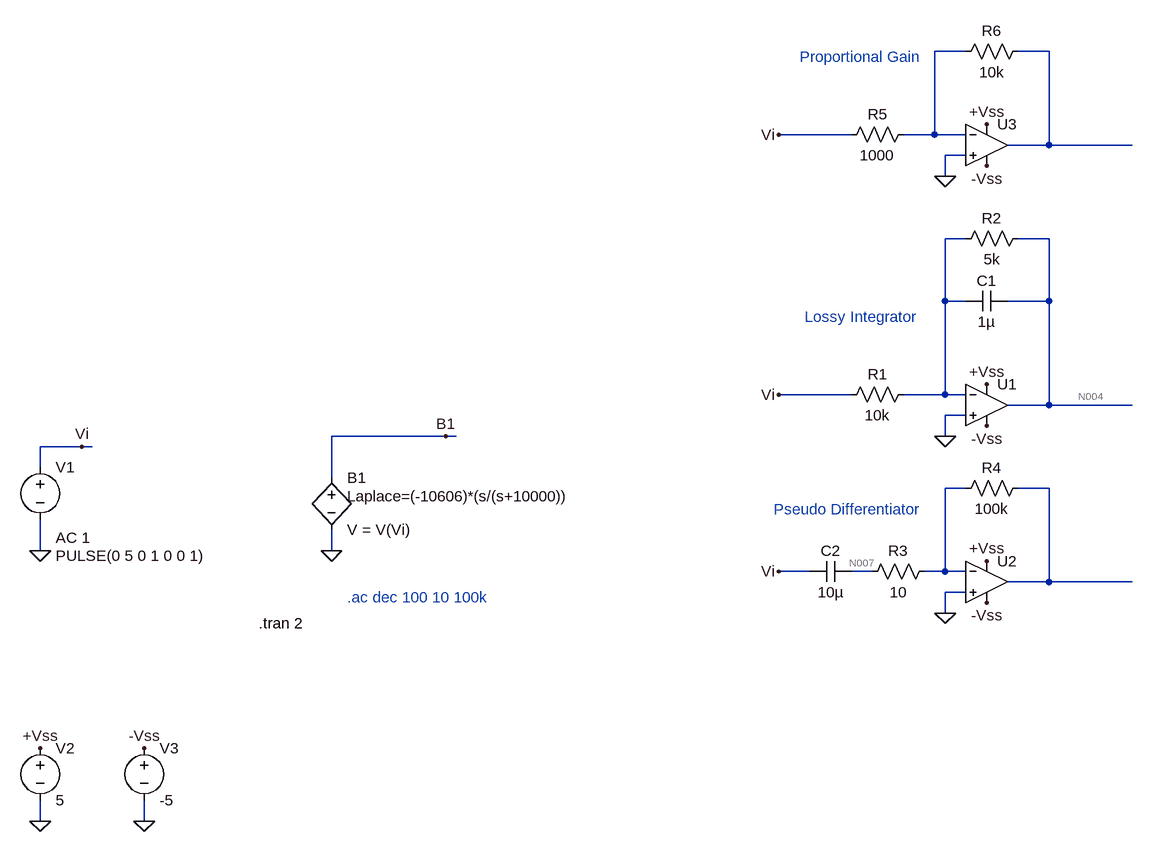
[diagram p0: schematic PID.asc]
PID.asc, the LTspice schematic file:
Version 4.1
SHEET 1 2436 884
WIRE 1152 -320 1104 -320
WIRE 1280 -320 1232 -320
WIRE 976 -192 864 -192
WIRE 1104 -192 1104 -320
WIRE 1104 -192 1056 -192
WIRE 1152 -192 1104 -192
WIRE 1280 -176 1280 -320
WIRE 1280 -176 1216 -176
WIRE 1408 -176 1280 -176
WIRE 1152 -160 1120 -160
WIRE 1120 -128 1120 -160
WIRE 1152 -32 1120 -32
WIRE 1280 -32 1232 -32
WIRE 1120 64 1120 -32
WIRE 1152 64 1120 64
WIRE 1280 64 1280 -32
WIRE 1280 64 1216 64
WIRE 976 208 864 208
WIRE 1120 208 1120 64
WIRE 1120 208 1056 208
WIRE 1152 208 1120 208
WIRE 1280 224 1280 64
WIRE 1280 224 1216 224
WIRE 1408 224 1280 224
WIRE 1152 240 1120 240
WIRE 352 272 176 272
WIRE 368 272 352 272
WIRE 1120 272 1120 240
WIRE -208 288 -272 288
WIRE -192 288 -208 288
WIRE -272 320 -272 288
WIRE 176 336 176 272
WIRE 1152 352 1120 352
WIRE 1280 352 1232 352
WIRE -272 448 -272 400
WIRE 176 448 176 416
WIRE 912 480 864 480
WIRE 1008 480 976 480
WIRE 1120 480 1120 352
WIRE 1120 480 1088 480
WIRE 1152 480 1120 480
WIRE 1280 496 1280 352
WIRE 1280 496 1216 496
WIRE 1408 496 1280 496
WIRE 1152 512 1120 512
WIRE 1120 544 1120 512
WIRE -272 864 -272 832
WIRE -112 864 -112 832
FLAG 176 448 0
FLAG -208 288 Vi
FLAG -272 448 0
FLAG 352 272 B1
FLAG 1120 272 0
FLAG 864 208 Vi
FLAG -272 864 0
FLAG -112 864 0
FLAG -272 752 +Vss
FLAG -112 752 -Vss
FLAG 1184 192 +Vss
FLAG 1184 256 -Vss
FLAG 864 480 Vi
FLAG 1120 544 0
FLAG 1184 528 -Vss
FLAG 1184 464 +Vss
FLAG 1120 -128 0
FLAG 864 -192 Vi
FLAG 1184 -144 -Vss
FLAG 1184 -208 +Vss
SYMBOL bv 176 320 R0
WINDOW 123 24 44 Left 2
SYMATTR Value2 Laplace=(-10606)*(s/(s+10000))
SYMATTR InstName B1
SYMATTR Value V = V(Vi)
SYMBOL voltage -272 304 R0
WINDOW 3 24 152 Left 2
WINDOW 123 24 124 Left 2
WINDOW 39 0 0 Left 0
SYMATTR Value PULSE(0 5 0 1 0 0 1)
SYMATTR Value2 AC 1
SYMATTR InstName V1
SYMBOL res 1072 192 R90
WINDOW 0 0 56 VBottom 2
WINDOW 3 32 56 VTop 2
SYMATTR InstName R1
SYMATTR Value 10k
SYMBOL res 1248 -48 R90
WINDOW 0 0 56 VBottom 2
WINDOW 3 32 56 VTop 2
SYMATTR InstName R2
SYMATTR Value 5k
SYMBOL voltage -272 736 R0
WINDOW 123 0 0 Left 0
WINDOW 39 0 0 Left 0
SYMATTR InstName V2
SYMATTR Value 5
SYMBOL voltage -112 736 R0
WINDOW 123 0 0 Left 0
WINDOW 39 0 0 Left 0
SYMATTR InstName V3
SYMATTR Value -5
SYMBOL OpAmps\\UniversalOpAmp2 1184 224 R0
SYMATTR InstName U1
SYMBOL cap 1216 48 R90
WINDOW 0 0 32 VBottom 2
WINDOW 3 32 32 VTop 2
SYMATTR InstName C1
SYMATTR Value 1µ
SYMBOL OpAmps\\UniversalOpAmp2 1184 496 R0
SYMATTR InstName U2
SYMBOL res 1104 464 R90
WINDOW 0 0 56 VBottom 2
WINDOW 3 32 56 VTop 2
SYMATTR InstName R3
SYMATTR Value 10
SYMBOL cap 976 464 R90
WINDOW 0 0 32 VBottom 2
WINDOW 3 32 32 VTop 2
SYMATTR InstName C2
SYMATTR Value 10µ
SYMBOL res 1248 336 R90
WINDOW 0 0 56 VBottom 2
WINDOW 3 32 56 VTop 2
SYMATTR InstName R4
SYMATTR Value 100k
SYMBOL OpAmps\\UniversalOpAmp2 1184 -176 R0
SYMATTR InstName U3
SYMBOL res 1072 -208 R90
WINDOW 0 0 56 VBottom 2
WINDOW 3 32 56 VTop 2
SYMATTR InstName R5
SYMATTR Value 1000
SYMBOL res 1248 -336 R90
WINDOW 0 0 56 VBottom 2
WINDOW 3 32 56 VTop 2
SYMATTR InstName R6
SYMATTR Value 10k
TEXT 200 520 Left 2 ;.ac dec 100 10 100k
TEXT 64 560 Left 2 !.tran 2
TEXT 856 384 Left 2 ;Pseudo Differentiator
TEXT 904 88 Left 2 ;Lossy Integrator
TEXT 896 -312 Left 2 ;Proportional Gain

The netlist it stands for:
* PID.asc
B1 B1 0 V = V(Vi) Laplace=(-10606)*(s/(s+10000))
V1 Vi 0 PULSE(0 5 0 1 0 0 1) AC 1
R1 N003 Vi 10k
R2 N004 N003 5k
V2 +Vss 0 5
V3 -Vss 0 -5
X§U1 0 N003 +Vss -Vss N004 level2 Avol=1Meg GBW=10Meg Slew=10Meg Ilimit=25m Rail=0 Vos=0 En=0 Enk=0 In=0 Ink=0 Rin=500Meg  ; pins In+ In- V+ V- OUT
C1 N004 N003 1µ
X§U2 0 N005 +Vss -Vss N006 level2 Avol=1Meg GBW=10Meg Slew=10Meg Ilimit=25m Rail=0 Vos=0 En=0 Enk=0 In=0 Ink=0 Rin=500Meg  ; pins In+ In- V+ V- OUT
R3 N005 N007 10
C2 N007 Vi 10µ
R4 N006 N005 100k
X§U3 0 N001 +Vss -Vss N002 level2 Avol=1Meg GBW=10Meg Slew=10Meg Ilimit=25m Rail=0 Vos=0 En=0 Enk=0 In=0 Ink=0 Rin=500Meg  ; pins In+ In- V+ V- OUT
R5 N001 Vi 1000
R6 N002 N001 10k
* .ac dec 100 10 100k
.tran 2
* Pseudo Differentiator
* Lossy Integrator
* Proportional Gain
.lib UniversalOpAmp2.lib
.backanno
.end

* Results of the author's LTspice run, read from the files saved beside the schematic
* Operating Point, zero values left out:
*   V(+vss) = 5 V
*   V(-vss) = -5 V
*   I(V2) = -1.5 mA
*   I(V3) = 1.5 mA
*   Ix(u2:3) = 500 µA
*   Ix(u2:4) = -500 µA
*   Ix(u1:3) = 500 µA
*   Ix(u1:4) = -500 µA
*   Ix(u3:3) = 500 µA
*   Ix(u3:4) = -500 µA
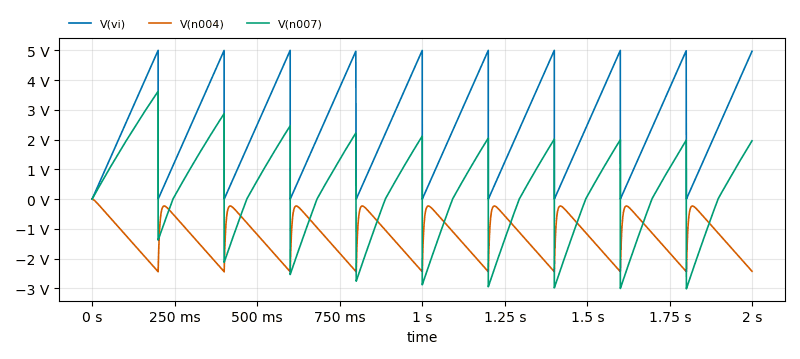
[diagram p1: Transient Analysis of PID.asc, plotted from the saved traces]
* Transient Analysis, 1 run:
*   V(vi): min 0 V, max 5 V, average 2.5 V, rms 2.888 V, last 5 V
*   V(n004): min -2.445 V, max 0 V, average -1.244 V, rms 1.415 V, last -2.437 V
*   V(n007): min -3.012 V, max 3.626 V, average 278.4 mV, rms 1.52 V, last 1.982 V